# EasyEDA Pro project ProDoc_PCB_ESP_AI_2025-02-27(1)(1).epro

# Board PCB_ESP_AI
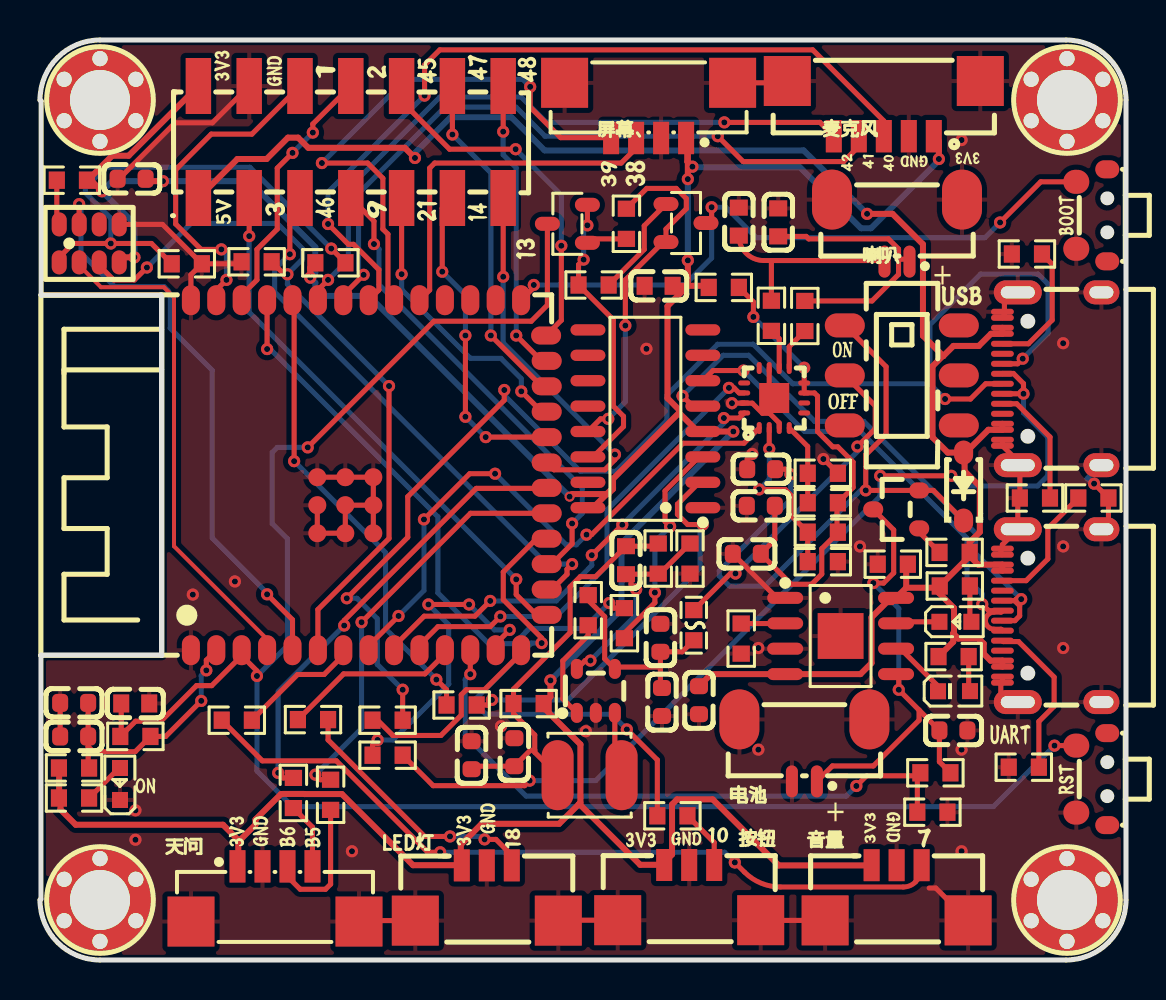
[diagram p0: board, top side]
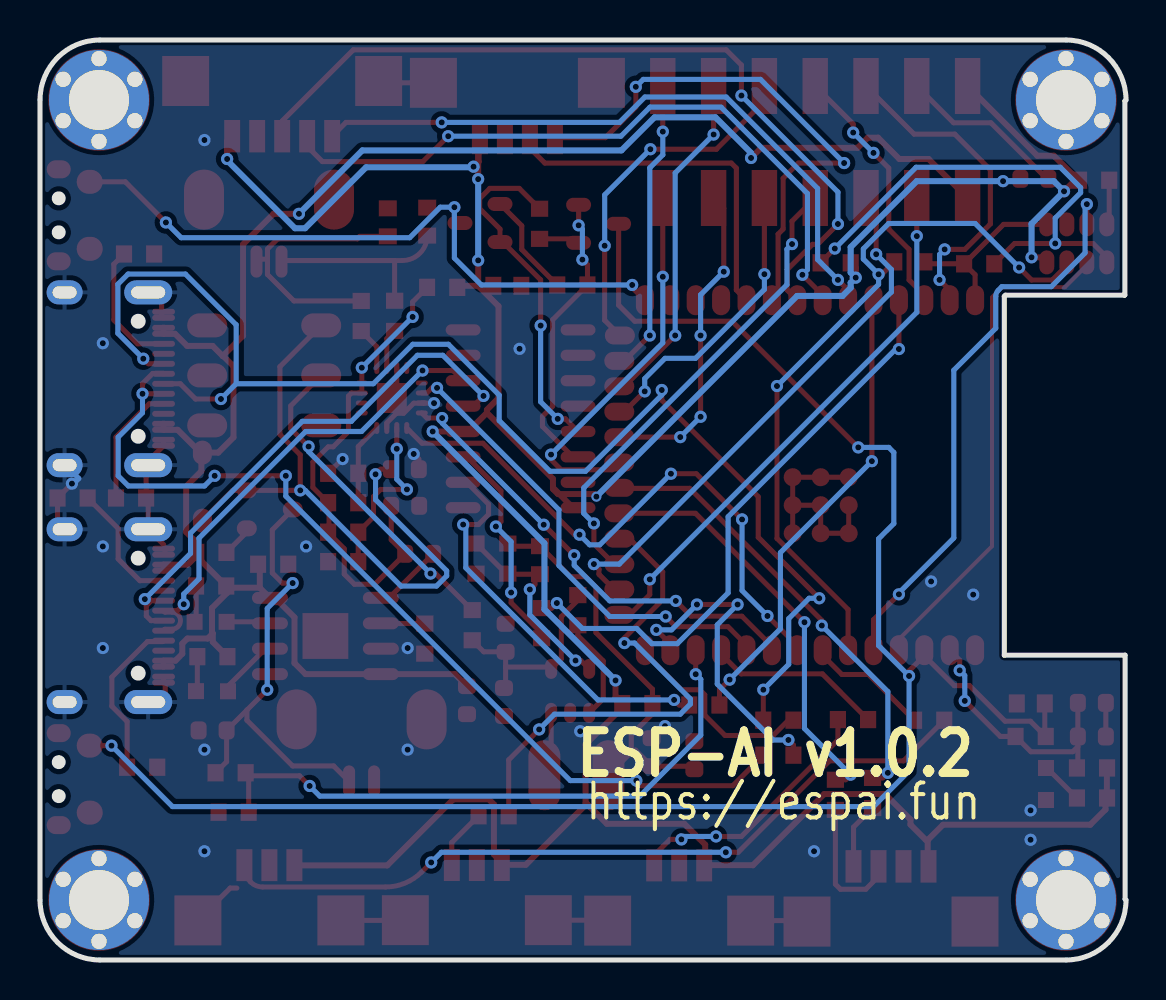
[diagram p1: board, bottom side, seen from below]

Outline 54.3 x 46 mm; copper layers: Top Layer, Bottom Layer. Coordinates in mm from the lower left corner of the outline.
Outline path: 0,43 0.06,42.94 0.06,33.26 0.07,33.24 6.03,33.24 6.08,33.18 6.08,15.24 0.05,15.24 0.05,3.05 0,3 arc(0.88,0.88) 3,0 51.3,0 arc(53.42,0.88) 54.3,3 54.3,43 arc(53.42,45.12) 51.3,46 3,46 arc(0.88,45.12) 0,43
Stack: Top Layer 0.035mm / Dielectric1 1.51mm FR4 er 4.5 / Bottom Layer 0.035mm

## Design rules (mm)
template: JLCPCB Capability(Two Layers Board)
spacing copperThickness1oz (default): track to track 0.102, other pairs 0.152 to 0.3
spacing copperThickness2oz: track to track 0.203, other pairs 0.152 to 0.3
track width copperThickness1oz (default): min 0.127, default 0.254, max 2.54
track width copperThickness2oz: min 0.203, default 0.254, max 2.54
differential pair differentialPair (default): width min 0.127, default 0.254, max 2.54; gap min 0.152, default 0.152
via viaSize (default): diameter min 0.5, default 0.61, max 10; hole min 0.3, default 0.305, max 6.3

## Placement (name value [footprint] x y rotation side)
C1  10uF  [C0603]  36.06 24.54 0 top
C2  10uF  [C0603]  31.02 16.11 270 top
C3  100nF  [C0603]  31.1 12.9 90 top
C4  22pF  [C0603_1]  29.3 19.99 90 top
C5  100nF  [C0603]  21.58 10.24 90 top
C6  10uF  [C0603]  23.72 10.39 90 top
C7  10uF  [C0603]  32.95 12.99 90 top
C8  10uF  [C0603]  45.67 11.48 180 top
C9  10uF  [C0603]  1.71 12.86 0 top
C10  100nF  [C0603]  1.71 11.18 0 top
C11  1uF  [C0603_1]  4.76 12.83 180 top
C12  100nF  [C0603]  4.58 39.06 180 top
C13  100nF  [C0603_1]  30.93 33.71 180 top
C14  10uF  [C0603]  36.04 22.71 180 top
C15  100nF  [C0603]  35.34 20.31 180 top
C16  220pF  [C0603_1]  36.91 36.88 270 top
C17  220pF  [C0603_1]  34.94 36.92 270 top
D1  B5819W SL  [SOD-123_L2.7-W1.6-LS3.7-RD-1]  46.18 23.67 90 top
F1  JK-SMD0603-100L  [F0603]  32.69 16.74 90 top
HDR2  PZ254-2-07-S  [HDR-SMD_14P-P2.54-V-M-R2-C7-LS7.4]  15.54 40.9 0 top
L1  2.2uH  [IND-SMD_L4.0-W4.0]  27.48 9.24 180 top
LED1  KT-0603R  [LED0603-RD]  4 8.8 90 top
LED2  KT-0603R  [LED0603-RD]  45.77 16.91 0 top
LED灯  HC-1.25-3PLT  [CONN-SMD_HC-1.25-3PLT]  22.34 3.35 0 top
M1  -  [M3*5安装孔]  3 3 0 top
M2  -  [M3*5安装孔]  51.35 3 0 top
M3  -  [M3*5安装孔]  3 43 0 top
M4  -  [M3*5安装孔]  51.35 43 0 top
Q1  AO3401A  [SOT-23_L2.9-W1.3-P1.90-LS2.4-BR]  42.81 22.53 0 top
Q4  SS8050  [SOT-23-3_L2.9-W1.3-P1.90-LS2.4-BR]  32.3 36.85 180 top
Q5  SS8050  [SOT-23-3_L2.9-W1.3-P1.90-LS2.4-BR]  26.37 36.81 0 top
R1  5.1kΩ  [R0603]  49.75 23.1 0 top
R2  5.1kΩ  [R0603]  49.35 35.3 180 top
R3  100kΩ  [R0603]  45.73 20.38 0 top
R4  100kΩ  [R0603]  42.64 19.79 0 top
R5  5.1kΩ  [R0603]  49.19 9.64 0 top
R6  5.1kΩ  [R0603]  52.67 23.1 0 top
R7  0Ω  [R0603_1]  24.43 12.82 0 top
R8  10kΩ  [R0603_1]  27.41 17.49 270 top
R9  680kΩ  [R0603_1]  30.91 20.07 90 top
R10  5.1kΩ  [R0603]  1.7 8.1 0 top
R11  150kΩ  [R0603_1]  32.5 20.07 90 top
R12  5.1kΩ  [R0603]  45.68 15.17 0 top
R13  5.1kΩ  [R0603]  45.74 18.7 0 top
R14  1kΩ  [R0603]  35.06 16.07 90 top
R15  300kΩ  [R0603]  44.77 9.36 0 top
R16  100kΩ  [R0603]  44.62 7.39 180 top
R17  0Ω  [R0603_1]  1.7 9.6 0 top
R18  10kΩ  [R0603_1]  4.77 11.18 0 top
R19  0Ω  [R0603_1]  17.38 10.24 0 top
R20  0Ω  [R0603_1]  17.38 11.99 0 top
R21  10kΩ  [R0603_1]  27.68 33.75 180 top
R22  0Ω  [R0603_1]  21.08 12.75 180 top
R23  0Ω  [R0603_1]  29.22 16.84 90 top
R24  100kΩ  [R0603]  10.83 34.91 0 top
R25  10kΩ  [R0603_1]  29.32 36.81 90 top
R26  10kΩ  [R0603_1]  1.59 38.99 0 top
R27  10kΩ  [R0603_1]  14.52 34.86 180 top
R28  10kΩ  [R0603_1]  7.34 34.81 0 top
R29  10kΩ  [R0603_1]  39.14 24.34 180 top
R30  10kΩ  [R0603_1]  39.14 22.86 180 top
R31  10kΩ  [R0603_1]  39.14 19.92 180 top
R32  10kΩ  [R0603_1]  39.14 21.39 180 top
R33  0Ω  [R0603_1]  34.19 33.63 0 top
R34  0Ω  [R0603_1]  36.57 32.21 90 top
R35  0Ω  [R0603_1]  38.24 32.2 90 top
R36  0Ω  [R0603_1]  14.53 8.26 90 top
R37  0Ω  [R0603_1]  12.67 8.35 90 top
R38  0Ω  [R0603_1]  9.84 11.99 0 top
R39  0Ω  [R0603_1]  31.62 7.21 180 top
R40  0Ω  [R0603_1]  13.65 12.02 180 top
SW1  MST22D18G2 125  [SW-SMD_MST22D18G2]  43.09 29.23 270 top
SW2  TS24CA  [SW-SMD_TS24CA]  52.59 37.23 270 top
SW3  TS24CA  [SW-SMD_TS24CA]  52.59 9.04 270 top
U1  24018-UCAF001-A  [TYPE-C-USB-SMD_CF003]  50.6 29.06 90 top
U2  24018-UCAF001-A  [TYPE-C-USB-SMD_CF003]  50.6 17.22 90 top
U3  ETA3409S2F  [SOT-23-5_L2.9-W1.6-P0.95-LS2.8-BL]  27.49 13.28 90 top
U4  AP5056  [SOP-8_L4.9-W3.9-P1.27-LS6.0-BL-EP]  40.03 16.2 270 top
U5  19-217/GHC-YR1S2/6T  [LED0603-RD_GREEN]  45.7 13.44 0 top
U7  ESP32-S3-WROOM-1-N16R8  [WIRELM-SMD_ESP32-S3-WROOM-1]  16.44 24.24 90 top
U8  CH340C  [SOP-16_L10.0-W3.9-P1.27-LS6.0-BL]  30.27 27.06 90 top
U9  MSM261S4030H0R  [MIC-SMD_8P-L4.0-W3.0-P1.00-BR]  2.46 35.83 90 top
U10  MAX98357AETE+T  [TQFN-16_L3.0-W3.0-P0.50-BL-EP1.5]  36.71 28.1 0 top
喇叭  HCZZ0015-2  [CONN-SMD_HCZZ0015-2]  42.85 36.47 180 top
天问  HC-1.25-4PLT  [CONN-SMD_4P-P1.25_HCTL_HC-1.25-4PLT]  11.75 3.3 0 top
屏幕、  HC-1.25-4PLT  [CONN-SMD_4P-P1.25_HCTL_HC-1.25-4PLT]  30.43 42.48 180 top
按钮  HC-1.25-3PLT  [CONN-SMD_HC-1.25-3PLT]  32.46 3.37 0 top
电池  HCZZ0015-2  [CONN-SMD_HCZZ0015-2]  38.22 10.48 180 top
音量  HC-1.25-3PLT  [CONN-SMD_HC-1.25-3PLT]  42.83 3.36 0 top
麦克风  HC-1.25-5PLT  [CONN-SMD_5P-P1.25_HCTL_HC-1.25-5PLT]  42.19 42.57 180 top

## Footprints (pads in the part's own frame, mm; a bottom-side part is the same pattern mirrored in y, then rotated)
C0603
  rrect 0.8x0.9 smd: 1(-0.7,0) 2(0.7,0)
C0603_1
  rect 0.8x0.9 smd: 1(-0.7,0) 2(0.7,0)
CONN-SMD_4P-P1.25_HCTL_HC-1.25-4PLT
  rect 0.8x1.62 smd: 1(-1.875,1.38) 2(-0.625,1.38) 3(0.625,1.38) 4(1.875,1.38)
  rect 2.35x2.5 smd: 5(-4.2,-1.38) 6(4.2,-1.38)
CONN-SMD_5P-P1.25_HCTL_HC-1.25-5PLT
  rect 0.8x1.62 smd: 1(-2.5,1.38) 2(-1.25,1.38) 3(0,1.38) 4(1.25,1.38) 5(2.5,1.38)
  rect 2.35x2.5 smd: 6(4.825,-1.38) 7(-4.825,-1.38)
CONN-SMD_HC-1.25-3PLT
  rect 0.8x1.6 smd: 1(-1.25,1.38) 2(0,1.38) 3(1.25,1.38)
  rect 2.35x2.5 smd: 4(-3.575,-1.38) 5(3.575,-1.38)
CONN-SMD_HCZZ0015-2
  oval 0.6x1.6 smd: 1(-0.625,1.55) 2(0.625,1.55)
  oval 2x3 smd: 3(-3.25,-1.55) 4(3.25,-1.55)
F0603
  rect 0.806x0.864 smd: 1(-0.753,0) 2(0.753,0)
HDR-SMD_14P-P2.54-V-M-R2-C7-LS7.4
  rect 1.27x2.8 smd: 1(-7.62,-2.8) 2(-7.62,2.8) 3(-5.08,-2.8) 4(-5.08,2.8) 5(-2.54,-2.8) 6(-2.54,2.8) 7(0,-2.8) 8(0,2.8) 9(2.54,-2.8) 10(2.54,2.8) 11(5.08,-2.8) 12(5.08,2.8) 13(7.62,-2.8) 14(7.62,2.8)
IND-SMD_L4.0-W4.0
  oval 1.6x3.5 smd: 1(-1.6,0) 2(1.6,0)
LED0603-RD
  rect 0.8x0.8 smd: 1(-0.799,0) 2(0.799,0)
LED0603-RD_GREEN
  rect 0.8x0.8 smd: 1(-0.799,-0.004) 2(0.799,0.004)
M3*5安装孔
  round 0.762 hole 0.762: 1(1.793,1.035) 2(0,2.07) 5(-1.793,1.035) 6(-1.792,-1.035) 8(0,-2.07) 9(1.792,-1.035)
  round 5.08 smd: 3(0,0)
  round 5 smd far side: 4(0,0)
  round 3.2 hole 3: 7(0,0)
MIC-SMD_8P-L4.0-W3.0-P1.00-BR
  oval 1.2x0.75 smd: 1(0.95,-1.5) 2(0.95,-0.5) 3(0.95,0.5) 4(0.95,1.5) 5(-0.95,1.5) 6(-0.95,0.5) 7(-0.95,-0.5) 8(-0.95,-1.5)
R0603
  rect 0.806x0.864 smd: 1(-0.753,0) 2(0.753,0)
R0603_1
  rect 0.806x0.864 smd: 1(-0.753,0) 2(0.753,0)
SOD-123_L2.7-W1.6-LS3.7-RD-1
  oval 1.2x0.95 smd: 1(-1.7,0) 2(1.7,0)
SOP-8_L4.9-W3.9-P1.27-LS6.0-BL-EP
  oval 0.6x1.8 smd: 1(-1.905,-2.772) 2(-0.635,-2.772) 3(0.635,-2.772) 4(1.905,-2.772) 5(1.905,2.772) 6(0.635,2.772) 7(-0.635,2.772) 8(-1.905,2.772)
  rect 2.29x2.29 smd: 9(0,0)
SOP-16_L10.0-W3.9-P1.27-LS6.0-BL
  oval 0.56x1.745 smd: 1(-4.445,-2.873) 2(-3.175,-2.873) 3(-1.905,-2.873) 4(-0.635,-2.873) 5(0.635,-2.873) 6(1.905,-2.873) 7(3.175,-2.873) 8(4.445,-2.873) 9(4.445,2.873) 10(3.175,2.873) 11(1.905,2.873) 12(0.635,2.873) 13(-0.635,2.873) 14(-1.905,2.873) 15(-3.175,2.873) 16(-4.445,2.873)
SOT-23-3_L2.9-W1.3-P1.90-LS2.4-BR
  oval 1.25x0.7 smd: 1(1,-0.95) 2(1,0.95) 3(-1,0)
SOT-23-5_L2.9-W1.6-P0.95-LS2.8-BL
  oval 1x0.6 smd: 1(-0.924,0.647) 2(-0.924,-0.302) 3(-0.924,-1.252) 4(1.276,-1.252) 5(1.276,0.647)
SOT-23_L2.9-W1.3-P1.90-LS2.4-BR
  oval 1x0.8 smd: 1(1.15,-0.95) 2(1.15,0.95) 3(-1.15,0)
SW-SMD_MST22D18G2
  oval 1.2x2 smd: 1(-2.5,2.85) 2(0,2.85) 3(2.5,2.85) 4(-2.5,-2.85) 5(0,-2.85) 6(2.5,-2.85)
SW-SMD_TS24CA
  oval 0.9x1.2 smd: 1(-2.3,0.775) 2(2.3,0.775)
  oval 1.2x1.3 smd: 3(-1.675,-0.775) 4(1.675,-0.775)
TQFN-16_L3.0-W3.0-P0.50-BL-EP1.5
  oval 0.25x0.6 smd: 1(-0.749,-1.5) 2(-0.248,-1.5) 3(0.252,-1.5) 4(0.751,-1.5) 9(0.75,1.5) 10(0.25,1.5) 11(-0.25,1.5) 12(-0.749,1.5)
  oval 0.6x0.25 smd: 5(1.5,-0.748) 6(1.5,-0.248) 7(1.5,0.252) 8(1.5,0.752) 13(-1.5,0.752) 14(-1.5,0.252) 15(-1.5,-0.248) 16(-1.5,-0.748)
  rect 1.5x1.5 smd: 17(0,0)
TYPE-C-USB-SMD_CF003
  oval 1.2x2.4 hole 0.6x1.7: 17(4.32,1.705) 20(-4.32,1.705)
  oval 1.2x1.8 hole 0.6x1.2: 18(4.32,-2.475) 19(-4.32,-2.475)
  oval 0.3x1.14 smd: A1(-3.35,2.474) A4(-2.55,2.471) A5(-1.25,2.475) A6(-0.25,2.475) A7(0.25,2.474) A8(1.25,2.475) A9(2.55,2.475) A12(3.35,2.475) B1(3.05,2.475) B4(2.25,2.475) B5(1.75,2.475) B6(0.75,2.475) B7(-0.75,2.474) B8(-1.75,2.475) B9(-2.25,2.471) B12(-3.05,2.474)
WIRELM-SMD_ESP32-S3-WROOM-1
  oval 1.5x0.9 smd: 1(-8.75,8.895) 2(-8.75,7.625) 3(-8.75,6.355) 4(-8.75,5.085) 5(-8.75,3.815) 6(-8.75,2.545) 7(-8.75,1.275) 8(-8.75,0.005) 9(-8.75,-1.265) 10(-8.75,-2.535) 11(-8.75,-3.805) 12(-8.75,-5.075) 13(-8.75,-6.345) 14(-8.75,-7.615) 27(8.75,-7.615) 28(8.75,-6.345) 29(8.75,-5.075) 30(8.75,-3.805) 31(8.75,-2.535) 32(8.75,-1.265) 33(8.75,0.005) 34(8.75,1.275) 35(8.75,2.545) 36(8.75,3.815) 37(8.75,5.085) 38(8.75,6.355) 39(8.75,7.625) 40(8.75,8.895)
  oval 0.9x1.5 smd: 15(-6.985,-8.895) 16(-5.715,-8.895) 17(-4.445,-8.895) 18(-3.175,-8.895) 19(-1.905,-8.895) 20(-0.635,-8.895) 21(0.635,-8.895) 22(1.905,-8.895) 23(3.175,-8.895) 24(4.445,-8.895) 25(5.715,-8.895) 26(6.985,-8.865)
  oval 0.9x0.9 smd: 41(-2.9,2.575) 41(-2.9,1.175) 41(-2.9,-0.225) 41(-1.5,2.575) 41(-1.5,1.175) 41(-1.5,-0.225) 41(-0.1,2.575) 41(-0.1,1.175) 41(-0.1,-0.225)

## Nets
GND: C1.1 C2.1 C3.1 C5.2 C6.2 C7.1 C8.1 C9.1 C10.1 C11.1 C12.2 C13.2 C14.2 C15.2 C16.1 C17.1 HDR2.4 LED1.1 LED灯.2 LED灯.4 LED灯.5 R1.1 R2.2 R4.1 R5.1 R6.2 R11.1 R14.1 R16.1 R24.1 R28.2 R29.1 R31.1 SW2.4 SW3.4 U1.17 U1.18 U1.19 U1.20 U1.A1 U1.A12 U1.B1 U1.B12 U2.17 U2.18 U2.19 U2.20 U2.A1 U2.A12 U2.B1 U2.B12 U3.2 U4.1 U4.3 U4.9 U7.1 U7.40 U7.41 U8.1 U9.1 U10.3 U10.11 U10.15 U10.17 喇叭.3 喇叭.4 天问.2 天问.5 天问.6 屏幕、.2 屏幕、.5 屏幕、.6 按钮.2 按钮.4 按钮.5 电池.2 电池.3 电池.4 音量.2 音量.4 音量.5 麦克风.2 麦克风.6 麦克风.7
VBAT: C8.2 Q1.3 R15.2 U4.5 电池.1
VCC_3V3: C12.1 C13.1 HDR2.2 LED灯.1 R7.2 R10.1 R17.1 R26.2 R27.2 R33.1 U8.4 U8.16 U9.8 天问.1 屏幕、.1 按钮.1 音量.1 麦克风.1
VCC_BOARD: F1.2 SW1.5
ASR_PB5: R37.1 天问.4
ASR_PB6: R36.1 天问.3
AUX_VCC: C1.2 D1.1 Q1.2 SW1.4
BAT_CHRG: LED2.1 U4.7
BAT_STBY: U4.6 U5.1
DTR: Q4.2 R25.2 U8.13
EN_RST: C11.2 Q5.3 R18.1 SW3.3 U7.3
GAIN_CTRL: R31.2 R32.2 U10.2
IO0_BOOT: Q4.3 SW2.3 U7.27
IO1_EXD: HDR2.6 U7.39
IO2_EXD: HDR2.8 U7.38
IO3_EXD: HDR2.3 U7.15
IO4_SCK: U7.4 U9.6
IO5_WS: U7.5 U9.3
IO6_SD: R24.2 U7.6 U9.7
IO7_KNOB: R38.2 U7.7
IO8_BAT_ADC: R15.1 R16.2 U7.12
IO9_EXD: HDR2.7 U7.17
IO10_BTN: R39.2 U7.18
IO11_TX_TW: R36.2 U7.19
IO12_RX_TW: R37.2 U7.20
IO13_EXD: HDR2.13 U7.21
IO14_EXD: HDR2.11 U7.22
IO15_DIN: U7.8 U10.1
IO16_BCLK: U7.9 U10.16
IO17_LR: U7.10 U10.14
IO18_LED: R40.2 U7.11
IO19_USB_D-: R19.2 U1.A7 U1.B7
IO20_USB_D+: R20.2 U1.A6 U1.B6
IO21_EXD: HDR2.9 U7.23
IO38_EXD: U7.31 屏幕、.3
IO39_EXD: U7.32 屏幕、.4
IO40_EXD: U7.33 麦克风.3
IO41_EXD: U7.34 麦克风.4
IO42_EXD: U7.35 麦克风.5
IO43_TX: R23.2 U7.37
IO44_RX: R22.2 U7.36
IO45_EXD: HDR2.10 U7.26
IO46_EXD: HDR2.5 U7.16
IO47_EXD: HDR2.12 U7.24
IO48_EXD: HDR2.14 U7.25
MAX_3V3: C14.1 C15.1 R30.1 R32.1 R33.2 U10.7 U10.8
RTS: Q5.2 R21.2 U8.14
SD_MODE: R29.2 R30.2 U10.4
USB_5V: C7.2 D1.2 HDR2.1 R3.2 R4.2 R12.1 R13.1 U1.A4 U1.A9 U1.B4 U1.B9 U2.A4 U2.A9 U2.B4 U2.B9 U4.4 U4.8
USB_D+: U2.A6 U2.B6 U8.5
USB_D-: U2.A7 U2.B7 U8.6
$1N4709: R1.2 U1.A5
$1N4722: R2.1 U1.B5
$1N5072: Q1.1 R3.1
$1N5555: LED1.2 R10.2
$1N6052: C4.2 C5.1 C6.1 L1.2 R7.1 R9.2
$1N6054: L1.1 U3.3
$1N6055: C4.1 R9.1 R11.2 U3.5
$1N6057: C2.2 C3.2 F1.1 R8.1 U3.4
$1N6058: R8.2 U3.1
$1N8206: R12.2 U5.2
$1N8207: LED2.2 R13.2
$1N8211: R14.2 U4.2
$1N11656: R6.1 U2.B5
$1N11663: R5.2 U2.A5
$2N631: C9.2 C10.2 R17.2 R18.2 U7.2
$2N764: R20.1 U7.14
$2N769: R19.1 U7.13
$3N640: R22.1 U8.2
$3N641: R23.1 U8.3
$3N2290: R34.1 U10.10
$3N2291: R35.1 U10.9
$3N2292: C17.2 R34.2 喇叭.2
$3N2293: C16.2 R35.2 喇叭.1
$3N9618: R26.1 U9.4
$3N9620: R27.1 R28.1 U9.5
$3N12428: Q4.1 R21.1
$3N12472: Q5.1 R25.1
$4N844: LED灯.3 R40.1
$4N967: R38.1 音量.3
$4N1500: R39.1 按钮.3

Pads without a net: M1 1 2 3 4 5 6 7 8 9; M2 1 2 3 4 5 6 7 8 9; M3 1 2 3 4 5 6 7 8 9; M4 1 2 3 4 5 6 7 8 9; SW1 1 2 3 6; SW2 1 2; SW3 1 2; U1 A8 B8; U2 A8 B8; U7 28 29 30; U8 7 8 9 10 11 12 15; U9 2; U10 5 6 12 13

## Via types
v1: diameter 0.61, hole 0.305, Top Layer to Bottom Layer, 143 vias
v2: diameter 0.5, hole 0.305, Top Layer to Bottom Layer, 1 via

## Routing (per net, layer and track width the routed paths; a pad name or vN(x,y) marks a point on that pad's centre or on a via; arc(x,y) is an arc through that point)
GND: length 71.1
  Top Layer w0.25: v1(35.61,25.3) 35.36,25.05 35.36,24.54 ; 36.48,27.33 36.12,27.33 35.61,27.84 35.11,27.84 ; 36.48,27.33 36.96,26.85 U10.3 ; 36.48,27.33 36.48,27.87 U10.17 36.46,28.35 U10.11 ; 35.11,27.84 v1(34.6,27.84) ; 35.11,27.84 U10.15 ; v1(39.17,25.05) 39.18,25.05 R29.1
  Top Layer w0.254: 34.63,43.86 37.27,43.86 麦克风.6 ; U1.B1 48.22,32.21 48.22,32.37 ; U4.1 36.85,18.11 34.64,20.31 ; U2.B12 U2.A1 48.04,13.79 48.04,12.9 U2.20 ; U7.41 U7.41 U7.41 U7.41 ; 48.22,32.37 48.22,33.38 U1.17 ; 48.22,32.37 48.17,32.37 U1.A12 ; U1.B12 U1.A1 48.89,24.94 U1.20 48.99,24.64 R1.1 48.89,23 U2.17 48.12,20.77 U2.A12 48.07,20.52 48.04,20.52 48.04,20.35 U2.B1 ; U9.1 6.12,36.78 R28.2 ; 音量.4 36.05,1.98 按钮.5 ; U7.40 7.55,34.26 R28.2 ; U7.41 U7.41 U7.41 U7.41 U7.41 ; U7.41 U7.41 ; 44.46,3.6 44.79,3.6 音量.5 ; 按钮.4 25.94,1.99 LED灯.5 ; HDR2.4 8.62,41.86 6.75,41.86 3.96,39.07 3.96,38.98 C12.2 ; R24.1 9.98,34.81 R28.2 ; v1(52.7,23.82) R6.2 53.42,21.89 U2.18 ; C10.1 C9.1 ; 48.73,35.16 R2.2 ; LED灯.4 15.97,1.97 15.95,1.95 天问.6
  Bottom Layer w0.254: v1(52.7,23.82) 52.61,23.82 52.36,24.07 53.03,24.74 U1.19
  vias: v1(4.77,7.48) v1(4.77,6.01) v1(7.64,18.27) v1(9.75,18.93) v1(15.6,5.44) v1(23.05,11.69) v1(27.29,11.44) v1(30.32,30.56) v1(35.92,15.6) v1(35.92,10.52) v1(41,20.68) v1(46.08,41) v1(46.08,10.52) v1(46.08,5.44) v1(51.16,30.84) v1(51.16,20.68) v1(51.16,15.6)
VBAT: length 23.6
  Top Layer w0.254: 43.95,12.5 C8.2 44.97,9.91 R15.2 ; 43.95,12.5 43.95,11.99 41.67,9.7 39.62,9.7 电池.1 ; 43.95,12.5 v1(42.94,13.51) 42.94,14.16 U4.5 ; v1(41.67,18.85) 42.18,18.85 42.68,19.35 42.68,21.51 Q1.3
  Bottom Layer w0.254: v1(42.94,13.51) 42.94,17.58 v1(41.67,18.85)
VCC_3V3: length 171.1
  Top Layer w0.3: 27.4,22.62 27.65,22.62 28.33,23.3 ; 21.08,4.74 LED灯.1 ; 21.08,4.74 21.04,4.78 21.04,5.77 22.09,6.81 25.96,6.81 26.96,7.81 26.96,7.81 ; 21.08,4.74 18.65,4.74 15.09,8.3 13.23,8.3 13.23,8.3 12.11,8.3 12.11,8.3 12.05,8.3 10.78,7.03 10.78,6.77 10,6 9.91,6 ; 31.03,4.76 31.09,4.76 31.6,5.28 31.6,7.78 31.86,8.03 33.63,8.03 36.94,4.73 41.57,4.73 音量.1 ; 31.03,4.76 按钮.1 ; 31.03,4.76 30.01,4.76 26.96,7.81 ; 28.65,23.62 28.65,23.55 28.4,23.3 28.33,23.3 ; 28.65,23.62 28.33,23.3 ; 28.65,23.62 28.65,24.06 31.95,27.36 ; 31.63,33.71 32.39,33.71 ; 32.39,33.71 31.38,32.69 31.38,28.09 31.95,27.51 31.95,27.36 ; 32.39,33.71 33.36,33.71 R33.1 ; 32.39,33.71 v1(32.39,34.98) ; 2.35,38.99 2.54,38.99 2.59,38.94 ; 0.96,8.1 R10.1 ; 0.96,8.1 0.96,9.59 R17.1 ; 0.96,8.1 1.02,8.03 1.02,7.52 1.79,6.76 9.15,6.76 9.91,6 ; 31.95,27.36 32.89,26.42 U8.4 v1(34.67,26.42) ; 9.91,6 9.91,4.72 9.87,4.68 ; v1(3.1,38.44) 2.59,38.94 ; 2.59,38.94 2.59,39.2 3.61,40.21 4.43,40.21 HDR2.2 ; 麦克风.1 44.94,40.94 v1(44.94,40.05) ; 28.33,23.3 26.61,23.3 v2(26.48,23.17) ; 32.37,41.1 屏幕、.1 ; 32.37,41.1 32.37,39.92 32.39,39.9 ; 32.37,41.1 32.39,41.08 32.39,39.9 ; v1(6.15,38.94) 5.4,38.94 5.28,39.06 ; 32.39,39.9 v1(32.62,39.67) ; 32.39,39.9 v1(32.39,39.04) ; 26.96,7.81 27.02,7.87 27.02,10.78 25.24,12.56 25.24,12.76 R7.2 25.52,13.16 v1(25.52,13.98) ; v1(4.72,35.13) 4.21,35.13 U9.8 ; R27.2 13.51,34.61 v1(13.51,34.12)
  Bottom Layer w0.3: v1(34.67,26.42) 29.08,20.84 29.08,17.53 v1(25.52,13.98) ; v2(26.48,23.17) 16.45,33.2 14.17,33.2 13.77,33.61 13.77,33.86 v1(13.51,34.12) 13.77,34.37 13.77,35.64 10.46,38.94 v1(6.15,38.94) 3.61,38.94 v1(3.1,38.44) 4.72,36.81 v1(4.72,35.13) ; v1(32.62,39.67) 32.65,39.64 38,39.64 41.04,36.59 41.55,36.59 44.94,39.98 v1(44.94,40.05) ; v1(32.39,34.98) v1(32.39,39.04)
VCC_BOARD: length 16.3
  Top Layer w0.254: 40.24,29.23 41.76,27.71 41.76,26.57 v1(40.87,25.67) ; F1.2 34.52,19.32 v1(34.77,19.32)
  Bottom Layer w0.254: v1(40.87,25.67) 40.87,25.42 v1(34.77,19.32)
ASR_PB5: length 3.3
  Top Layer w0.254: 13.62,4.68 13.62,6.64 R37.1
ASR_PB6: length 6.7
  Top Layer w0.254: R36.1 14.53,3.79 14.28,3.54 13.01,3.54 12.5,4.05 12.5,4.55 12.37,4.68
AUX_VCC: length 32
  Top Layer w0.254: D1.1 44.67,23.48 v1(41.29,23.48) 41.29,25.26 42.3,26.27 42.3,29.67 40.24,31.73 ; C1.2 37.27,24.54 v1(37.52,24.29)
  Bottom Layer w0.254: v1(37.52,24.29) 37.52,23.02 33.97,19.46 33.97,19.21 34.47,18.7 36.25,18.7 41.03,23.48 v1(41.29,23.48)
BAT_CHRG: length 2.2
  Top Layer w0.254: U4.7 42.88,16.91 LED2.1
BAT_STBY: length 3.1
  Top Layer w0.254: U4.6 43.03,15.56 44.83,13.76 44.83,13.5 U5.1
DTR: length 17.7
  Top Layer w0.254: U8.13 28.03,27.06 v1(28.41,27.06) ; 31.3,36.04 29.27,34.01 v1(29.27,31.72) ; 31.3,36.04 31.3,36.55 32.32,37.56 32.32,38.07 31.81,38.58 30.34,38.58 R25.2 ; 31.3,36.04 Q4.2
  Bottom Layer w0.254: v1(28.41,27.06) 29.27,27.91 v1(29.27,31.72)
EN_RST: length 91.7
  Top Layer w0.254: v1(13.39,25.63) 19.7,31.94 24.56,31.94 25.37,32.75 Q5.3 ; v1(50.73,10.72) 51.81,10.72 ; 4.06,11.22 4.78,11.94 6.05,11.94 7.83,13.72 8.59,13.72 10.08,15.22 ; 4.06,11.22 R18.1 ; 4.06,11.22 C11.2 ; v1(10.85,14.2) 10.85,14.45 10.08,15.22 ; 10.08,15.22 U7.3
  Bottom Layer w0.254: v1(13.39,25.63) 11.86,25.63 11.61,25.38 11.61,21.82 12.37,21.06 12.37,15.72 v1(10.85,14.2) 10.85,9.45 12.63,7.67 47.68,7.67 v1(50.73,10.72)
GAIN_CTRL: length 8.7
  Top Layer w0.25: v1(36.46,25.56) U10.2 ; v1(35.95,23.53) 37.26,23.53 37.62,23.17 37.62,22.15 R32.2
  Top Layer w0.254: R31.2 R32.2
  Bottom Layer w0.25: v1(36.46,25.56) 36.46,24.04 v1(35.95,23.53)
IO0_BOOT: length 33.9
  Top Layer w0.254: U7.27 24.69,33.63 v1(24.69,33.75) ; v1(48,36.88) 50.04,38.91 SW2.3 ; v1(33.58,37.64) 33.58,37.13 Q4.3
  Bottom Layer w0.254: v1(24.69,33.75) 32.23,33.75 33.58,35.1 v1(33.58,37.64) 34.29,37.64 35.81,36.12 47.24,36.12 v1(48,36.88)
IO1_EXD: length 16.3
  Top Layer w0.254: U7.39 8.82,33.5 v1(9.32,34.01) ; HDR2.6 10.59,41.29 8.56,41.29 6.78,39.52 6.78,36.8 8.05,35.53 v1(9.07,35.53)
  Bottom Layer w0.254: v1(9.32,34.01) 9.32,35.28 v1(9.07,35.53)
IO2_EXD: length 13
  Top Layer w0.254: v1(13.64,41.37) 13.64,41.8 HDR2.8 ; v1(12.63,40.36) 11.86,39.59 11.86,36.55 10.85,35.53 10.85,34.01 10.08,33.24 U7.38
  Bottom Layer w0.254: v1(12.63,40.36) v1(13.64,41.37)
IO3_EXD: length 27.3
  Top Layer w0.254: v1(10.46,36.19) HDR2.3 ; v1(23.81,19.03) 23.81,18.27 24.83,17.26 U7.15
  Bottom Layer w0.254: v1(23.81,19.03) 10.46,32.38 v1(10.46,36.19)
IO4_SCK: length 25.1
  Top Layer w0.2: U9.6 1.96,34.73 3.05,33.64 6.19,33.64 6.7,33.13 6.7,20.69 11.36,16.03 U7.4
IO5_WS: length 29.2
  Top Layer w0.254: v1(1.96,37.79) 1.96,36.78 ; v1(11.36,18.28) 12.63,17.01 U7.5
  Bottom Layer w0.254: v1(1.96,37.79) 2.05,37.7 2.05,35.35 3.73,33.67 6.2,33.67 6.39,33.49 arc(6.48,33.35) 6.51,33.18 6.51,31.59 8.61,29.49 8.61,21.1 11.36,18.35 v1(11.36,18.28)
IO6_SD: length 37.3
  Top Layer w0.254: v1(5.35,34.63) 4.72,34 3.68,34 2.96,34.73 U9.7 ; U7.6 13.89,17.52 17.45,21.08 v1(17.45,28.7) ; v1(12.37,34.29) 12.21,34.29 R24.2
  Bottom Layer w0.254: v1(17.45,28.7) 12.37,33.78 v1(12.37,34.29) 13.13,35.05 13.13,35.56 11.86,36.83 7.55,36.83 v1(5.35,34.63)
IO7_KNOB: length 6.2
  Top Layer w0.254: U7.7 15.17,15.24 14.2,14.28 12.88,14.28 R38.2
IO8_BAT_ADC: length 30.7
  Top Layer w0.254: v1(40.82,8.7) 41.33,9.21 43.87,9.21 ; R15.1 43.87,9.21 ; 43.87,9.21 R16.2 ; v1(21.51,14.29) U7.12
  Bottom Layer w0.254: v1(40.82,8.7) 40.31,8.19 24.31,8.19 21.26,11.24 21.26,14.04 v1(21.51,14.29)
IO9_EXD: length 24
  Top Layer w0.254: HDR2.7 16.7,36.94 v1(16.7,35.8) ; U7.17 25.59,19.8 26.61,20.81 v1(26.61,21.83)
  Bottom Layer w0.254: v1(26.61,21.83) 27.11,22.34 27.11,23.61 16.95,33.77 16.95,35.54 v1(16.7,35.8)
IO10_BTN: length 25
  Top Layer w0.254: 25.33,21.06 25.2,20.93 24.69,20.93 23.16,19.4 23.16,18.02 25.08,16.1 v1(25.08,15.85) ; v1(29.34,11.53) 30.87,10 R39.2
  Bottom Layer w0.254: v1(29.34,11.53) 28.58,12.29 22.29,12.29 21.78,12.8 21.78,13.05 24.57,15.85 v1(25.08,15.85)
IO11_TX_TW: length 21
  Top Layer w0.254: U7.19 21.52,22.34 v1(16.08,16.89) ; R36.2 14.02,9.01 v1(13.77,9.27)
  Bottom Layer w0.254: v1(16.08,16.89) 16.08,11.58 v1(13.77,9.27)
IO12_RX_TW: length 22.7
  Top Layer w0.254: v1(11.91,9.36) 12.16,9.1 R37.2 ; U7.20 25.31,23.58 21.81,23.58 15.21,16.98 v1(15.21,16.72)
  Bottom Layer w0.254: v1(11.91,9.36) 11.91,13.42 v1(15.21,16.72)
IO13_EXD: length 19.2
  Top Layer w0.254: v1(23.16,34.16) HDR2.13 ; v1(28.75,25.27) 28.75,25.02 28.24,24.51 25.7,24.51 U7.21
  Bottom Layer w0.254: v1(28.75,25.27) 23.16,30.86 v1(23.16,34.16)
IO14_EXD: length 16.1
  Top Layer w0.254: v1(20.11,34.42) 20.11,37.59 HDR2.11 ; v1(21.27,27.16) v1(21.27,31.23) ; U7.22 v1(22.29,26.15)
  Bottom Layer w0.254: v1(20.11,34.42) 21.27,33.26 v1(21.27,31.23) ; v1(22.29,26.15) v1(21.27,27.16)
IO15_DIN: length 29.3
  Top Layer w0.25: U10.1 35.2,25.84 32.15,25.84 27.58,21.27 v1(27.33,21.27) ; v1(19.2,22.03) 21.48,24.31 v1(22.75,24.31) ; v1(17.93,17.2) 16.44,15.71 U7.8
  Bottom Layer w0.25: v1(27.33,21.27) 26.82,20.76 26.31,20.76 v1(22.75,24.31) ; v1(17.93,17.2) 19.2,18.47 v1(19.2,22.03)
IO16_BCLK: length 23
  Top Layer w0.25: v1(34.19,27.1) 34.96,27.1 U10.16 ; U7.9 17.7,15.69 19.21,17.19 21.75,17.19 v1(22.51,17.95) ; v1(29.11,21.76) v1(27.59,20.24)
  Bottom Layer w0.25: v1(22.51,17.95) 25.81,17.95 27.59,19.73 v1(27.59,20.24) ; v1(34.19,27.1) 34.19,26.84 v1(29.11,21.76)
IO17_LR: length 23.6
  Top Layer w0.25: v1(34.45,28.61) 34.7,28.61 34.96,28.35 U10.14 ; U7.10 18.98,15.74 19.9,16.67 22.51,16.67 v1(23.02,17.18)
  Bottom Layer w0.25: v1(23.02,17.18) 25.81,17.18 28.35,19.72 28.35,22.51 v1(34.45,28.61)
IO18_LED: length 8.9
  Top Layer w0.254: R40.2 15.18,14.31 19.25,14.31 20.25,15.3 U7.11
IO19_USB_D-: length 47.8
  Top Layer w0.254: U1.B7 v1(49.17,28.31) 49.17,28.82 48.67,29.33 48.14,29.33 U1.A7 ; v1(24.48,8.97) 24.23,8.72 19.66,8.72 R19.2 ; v1(42.01,24.21) v1(45.57,24.21)
  Bottom Layer w0.254: v1(45.57,24.21) 46.07,23.7 49.88,23.7 50.39,24.21 50.39,26.14 49.17,27.36 v1(49.17,28.31) ; v1(24.48,8.97) 27.79,8.97 42.01,23.19 v1(42.01,24.21)
IO20_USB_D+: length 68.3
  Top Layer w0.254: v1(49.14,30.07) 48.88,29.81 U1.B6 ; v1(15.34,18.09) 18.39,21.13 18.39,23.17 23.21,27.99 v1(23.21,28.5) ; R20.2 v1(18.13,13.51) ; U1.A6 47.29,28.81 46.52,28.05 v1(45.25,28.05)
  Bottom Layer w0.254: 44.49,28.81 v1(45.25,28.05) ; 44.49,28.81 44.49,31.76 47.03,34.3 49.9,34.3 50.41,33.79 50.41,31.34 v1(49.14,30.07) ; 44.49,28.81 37.63,28.81 35.66,30.79 33.88,30.79 31.34,28.25 31.34,26.98 28.8,24.44 27.02,24.44 23.21,28.25 v1(23.21,28.5) ; v1(18.13,13.51) 16.86,14.78 16.86,17.07 15.85,18.09 v1(15.34,18.09)
IO21_EXD: length 14.7
  Top Layer w0.254: v1(24.07,28.43) 25.08,27.42 U7.23 ; v1(18.08,34.29) HDR2.9
  Bottom Layer w0.254: v1(24.07,28.43) 24.07,29.07 23.05,30.08 21.52,30.08 18.08,33.53 v1(18.08,34.29)
IO38_EXD: length 18.1
  Top Layer w0.254: 屏幕、.3 29.8,40.59 29.06,39.85 19.74,39.85 19.48,39.59 19.48,33.5 U7.31
IO39_EXD: length 27.7
  Top Layer w0.254: U7.32 17.4,33.3 17.4,36.29 17.14,36.55 17.14,39.09 16.38,39.85 v1(14.1,39.85) ; 屏幕、.4 28.54,41.12 26.03,41.12 24.51,42.64 v1(24.51,43.66)
  Bottom Layer w0.254: v1(24.51,43.66) 24.14,44.03 18.28,44.03 v1(14.1,39.85)
IO40_EXD: length 40.7
  Top Layer w0.254: v1(19.23,43.22) 19.23,44.75 19.99,45.51 38.63,45.51 42.19,41.95 麦克风.3 ; v1(14.4,36.8) 15.42,35.78 15.67,35.78 16.94,34.51 16.94,33.5 U7.33
  Bottom Layer w0.254: v1(14.4,36.8) 14.4,38.4 v1(19.23,43.22)
IO41_EXD: length 34.6
  Top Layer w0.254: v1(16.18,34.26) 15.17,33.24 U7.34 ; v1(33.89,41.19) 35.16,39.92 40.18,39.92 40.94,40.68 麦克风.4
  Bottom Layer w0.254: v1(33.89,41.19) 25.25,41.19 23.8,42.64 20.25,42.64 15.93,38.32 15.93,34.51 v1(16.18,34.26)
IO42_EXD: length 33.2
  Top Layer w0.254: v1(34.22,41.88) 39,41.88 麦克风.5 ; v1(14.4,34.01) 13.89,33.5 U7.35
  Bottom Layer w0.254: v1(34.22,41.88) 25.33,41.88 24.05,43.15 19.99,43.15 15.42,38.58 15.42,35.02 v1(14.4,34.01)
IO43_TX: length 29.6
  Top Layer w0.254: v1(28.46,17.85) 28.71,17.59 R23.2 ; v1(11.36,30.55) U7.37
  Bottom Layer w0.254: v1(28.46,17.85) 27.19,16.58 24.47,16.58 23.7,15.82 22.43,15.82 19.89,18.36 19.89,22.17 11.51,30.55 v1(11.36,30.55)
IO44_RX: length 23.4
  Top Layer w0.254: v1(12.71,24.94) 12.71,32.91 U7.36 ; R22.2 20.33,13.51 v1(19.82,14.02)
  Bottom Layer w0.254: v1(19.82,14.02) 17.28,16.56 17.28,20.37 v1(12.71,24.94)
IO45_EXD: length 18
  Top Layer w0.254: v1(23.78,40.54) 20.48,40.54 18.19,42.83 18.19,43.59 HDR2.10 ; v1(26.07,35.71) 26.07,31.99 U7.26
  Bottom Layer w0.254: v1(26.07,35.71) 26.07,38.25 v1(23.78,40.54)
IO46_EXD: length 27.7
  Top Layer w0.254: U7.16 25.59,18.53 26.35,19.29 26.35,19.54 v1(26.61,19.8) ; v1(12.49,35.29) 12.49,37.59 HDR2.5
  Bottom Layer w0.254: v1(12.49,35.29) 11.73,34.53 11.73,33.4 25.33,19.8 v1(26.61,19.8)
IO47_EXD: length 17.1
  Top Layer w0.254: v1(20.62,41.27) HDR2.12 ; 25.33,28.69 25.08,28.69 v1(22.54,31.23)
  Bottom Layer w0.254: v1(20.62,41.27) 22.54,39.35 v1(22.54,31.23)
IO48_EXD: length 14.8
  Top Layer w0.254: v1(23.81,31.23) 25.08,29.95 U7.25 ; v1(23.16,41.42) HDR2.14
  Bottom Layer w0.254: v1(23.16,41.42) 23.16,40.26 23.81,39.61 v1(23.81,31.23)
MAX_3V3: length 24.5
  Top Layer w0.25: v1(35.67,32.15) 35.67,32.9 R33.2 ; R30.1 40.66,23.63 40.66,24.9 39.89,25.66 39.64,25.66 38.88,26.42 38.88,28.2 38.72,28.35 U10.7 U10.8 v1(38.21,29.61)
  Top Layer w0.254: C14.1 36.74,21.01 C15.1 37.56,18.79 38.58,18.79 39.09,19.29 39.09,20.56 39.85,21.33 ; R30.1 39.85,22.82 39.85,21.33 ; 39.85,21.33 R32.1
  Bottom Layer w0.25: v1(38.21,29.61) v1(35.67,32.15)
RTS: length 14.6
  Top Layer w0.254: U8.14 27.66,25.16 29.18,26.67 29.18,27.18 28.67,27.69 28.67,32.01 R21.2 26.93,34.77 v1(27.18,35.02) ; v1(27.37,36.73) Q5.2
  Bottom Layer w0.254: v1(27.37,36.73) 27.18,36.54 v1(27.18,35.02)
SD_MODE: length 4.1
  Top Layer w0.25: R29.2 38.39,25.67 U10.4
  Top Layer w0.254: R29.2 R30.2
USB_5V: length 94.4
  Top Layer w0.3: 46.48,20.2 R3.2 46.48,20.89 46.99,21.4 46.99,23.68 46.23,24.44 46.23,25.32 ; 46.48,20.2 R13.1 44.9,18.61 ; 46.48,20.2 46.91,19.77 U2.A9 U2.B4 ; 46.23,25.32 47.42,26.51 U1.A4 U1.B9 ; 46.23,25.32 D1.2 45.39,25.37 44.63,26.13 44.63,29.69 45.13,30.2 45.16,30.2 ; 45.66,16.33 45.66,15.91 R12.1 ; 45.66,16.33 45.7,16.37 45.7,17.6 44.94,18.36 44.94,18.57 44.9,18.61 ; 45.66,16.33 45.92,16.07 46.93,16.07 47.19,15.82 47.19,15.31 47.53,14.97 U2.B9 U2.A4 ; 45.16,30.2 45.67,30.7 46.94,30.7 47.55,31.31 U1.B4 U1.A9 ; 45.16,30.2 44.15,31.21 44.15,35.78 42.62,37.31 v1(41.35,37.31) ; 43.31,18.61 44.9,18.61 ; 43.31,18.61 U4.8 42.59,17.89 42.34,17.89 41.58,17.13 41.58,14.85 41.02,14.3 U4.4 33.55,14.3 C7.2 ; 43.31,18.61 43.31,19.71 R4.2 ; HDR2.1 9.87,40.05 11.33,40.05 12.4,41.12 12.91,41.12 13.41,40.61 18.24,40.61 v1(18.75,40.1)
  Bottom Layer w0.3: v1(18.75,40.1) 18.75,40.36 20.53,42.13 23.57,42.13 25.23,40.48 38.18,40.48 v1(41.35,37.31)
USB_D+: length 27.4
  Top Layer w0.254: 48.73,17.97 48.81,18.04 v1(49.06,18.04) ; 48.73,17.97 U2.B6 ; 48.73,17.97 48.98,17.71 48.98,17.2 48.75,16.97 U2.A6 ; v1(32.13,28.2) 32.63,27.7 U8.5
  Bottom Layer w0.254: v1(32.13,28.2) 34.16,30.23 35.43,30.23 38.73,26.93 41.19,26.93 46.77,21.34 46.77,20.33 v1(49.06,18.04)
USB_D-: length 23.9
  Top Layer w0.245: U2.A7 arc(48.1,17.41) 48.05,17.39 47.7,17.39 arc(47.28,16.97) 47.7,16.54 48.05,16.54 arc(48.1,16.52) U2.B7
  Top Layer w0.254: U8.6 33.65,29.47 v1(35.17,29.47) ; U2.A7 47.44,17.47 v1(47.11,17.79)
  Bottom Layer w0.254: v1(35.17,29.47) 38.22,26.42 41.02,26.42 46.35,21.09 46.35,19.06 47.11,18.3 v1(47.11,17.79)
$1N4709: length 6.1
  Top Layer w0.254: U1.A5 48.84,27.81 50.5,26.15 R1.2
$1N4722: length 6.5
  Top Layer w0.254: R2.1 50.61,34.79 50.61,32 49.42,30.81 U1.B5
$1N5072: length 1.6
  Top Layer w0.254: 43.96,21.58 43.96,21.4 R3.1
$1N5555: length 2.2
  Top Layer w0.254: LED1.2 3.95,9.6 2.45,8.1
$1N6052: length 20.4
  Top Layer w0.254: C5.1 21.73,9.69 C6.1 24.52,10.49 24.74,10.49 ; 24.74,10.49 24.74,10.38 L1.2 ; 24.74,10.49 24.74,11.25 23.68,12.31 R7.1 23.68,13.54 26.51,16.37 26.51,18.66 27.01,19.17 27.78,19.17 C4.2 30.78,20.69 R9.2
$1N6054: length 3.3
  Top Layer w0.254: L1.1 28.74,9.58 U3.3
$1N6055: length 10.1
  Top Layer w0.254: U3.5 27.26,14.97 v1(27.52,14.97) ; v1(29.81,18.53) 29.55,18.78 29.55,19.29 ; R11.2 30.99,19.32 R9.1 30.88,19.29 29.55,19.29 ; 29.55,19.29 C4.1
  Bottom Layer w0.254: v1(29.81,18.53) 29.81,17.26 v1(27.52,14.97)
$1N6057: length 10.3
  Top Layer w0.254: R8.1 27.41,17.99 28.23,17.17 28.23,15.06 U3.4 28.83,14.65 31.02,14.65 ; 31.02,14.65 31.02,13.68 C3.2 ; 31.02,14.65 C2.2 32.11,15.41 F1.1
$1N6058: length 5.2
  Top Layer w0.254: R8.2 27.41,16.23 26.14,14.96 26.14,13.06 U3.1
$1N8206: length 1.8
  Top Layer w0.254: R12.2 46.43,13.51 U5.2
$1N8207: length 1.8
  Top Layer w0.254: LED2.2 46.49,16.99 R13.2
$1N8211: length 2.2
  Top Layer w0.254: U4.2 37.25,16.82 R14.2
$1N11656: length 6.4
  Top Layer w0.254: R6.1 50.39,21.58 50.39,20.05 49.31,18.97 U2.B5
$1N11663: length 8.2
  Top Layer w0.254: R5.2 49.94,11.93 50.71,12.69 50.71,14.14 48.93,15.92 48.17,15.92 U2.A5
$2N631: length 12.9
  Top Layer w0.254: 2.41,10.67 C10.2 C9.2 ; 2.41,10.67 2.41,9.65 2.45,9.6 ; 2.41,10.67 2.66,10.41 4.76,10.41 R18.2 6.28,11.18 v1(8.06,12.96) ; v1(8.32,14.48) 8.32,14.99 U7.2
  Bottom Layer w0.254: v1(8.06,12.96) 8.06,14.23 v1(8.32,14.48)
$2N764: length 10.2
  Top Layer w0.254: U7.14 24.05,15.34 22.23,13.51 21.32,13.51 21.06,13.26 21.06,12.24 20.05,11.23 17.64,11.23 16.88,11.99 R20.1
$2N769: length 15.9
  Top Layer w0.254: R19.1 16.63,10.75 v1(16.88,11) ; v1(19.42,17.78) v1(21.45,17.78) ; v1(23.48,16.51) 22.79,15.81 U7.13
  Bottom Layer w0.254: v1(21.45,17.78) 22.72,16.51 v1(23.48,16.51) ; v1(19.42,17.78) 20.44,16.76 20.44,13.8 17.64,11 v1(16.88,11)
$3N640: length 19.9
  Top Layer w0.254: v1(22.6,13) 22.34,12.75 R22.1 ; v1(33.14,21.77) 32.38,21.77 31.87,22.28 31.87,22.79 32.89,23.81 33.06,23.81 U8.2
  Bottom Layer w0.254: v1(33.14,21.77) 33.01,21.64 33.01,19.61 26.41,13 v1(22.6,13)
$3N641: length 11
  Top Layer w0.254: v1(31.51,21.67) 31.25,21.93 31.25,23.45 32.95,25.16 U8.3 ; v1(30.74,18.37) 30.74,17.86 29.22,16.34 R23.1
  Bottom Layer w0.254: v1(31.51,21.67) 30.74,20.91 v1(30.74,18.37)
$3N2290: length 2
  Top Layer w0.25: R34.1 36.96,31.07 U10.10
$3N2291: length 2.2
  Top Layer w0.25: R35.1 37.46,30.67 U10.9
$3N2292: length 10
  Top Layer w0.245: 36.57,34.97 36.19,34.97 arc(35.3,35.34) C17.2
  Top Layer w0.254: R34.2 36.57,34.97 42.17,34.97 喇叭.2
$3N2293: length 13.4
  Top Layer w0.254: 42.93,35.04 43.36,35.04 喇叭.1 ; 42.93,35.04 42.93,35.55 42.42,36.06 38.43,36.06 38.31,36.18 C16.2 ; 42.93,35.04 42.93,34.28 41.6,32.95 R35.2
$3N9618: length 2.3
  Top Layer w0.254: R26.1 0.84,36.9 U9.4
$3N9620: length 25.3
  Top Layer w0.254: U9.5 0.96,35.13 1.65,35.83 v1(3.54,35.83) 5.57,35.83 R28.1 ; v1(14.56,35.57) R27.1
  Bottom Layer w0.254: v1(14.56,35.57) 10.5,39.64 3.28,39.64 2.27,38.62 2.27,38.37 3.54,37.1 v1(3.54,35.83)
$3N12428: length 5.2
  Top Layer w0.254: R21.1 30.21,35.53 30.21,36.71 Q4.1
$3N12472: length 2
  Top Layer w0.254: R25.1 27.57,36.06 Q5.1
$4N844: length 13.1
  Top Layer w0.254: R40.1 14.4,11 19.23,6.18 v1(20.5,6.18) ; v1(22.23,6.03) 22.8,6.03 23.55,5.28 23.55,4.77 LED灯.3
  Bottom Layer w0.254: v1(20.5,6.18) 22.08,6.18 v1(22.23,6.03)
$4N967: length 39
  Top Layer w0.245: 音量.3 44.08,4.65 arc(44,4.24) 43.77,3.9 arc(43.49,3.71) 43.17,3.65 37.02,3.65 arc(36.05,3.84) 35.22,4.39 v1(34.74,4.88)
  Top Layer w0.254: R38.1 11.12,9.96 14.82,9.96 19.39,5.39 v1(20.01,5.39)
  Bottom Layer w0.254: v1(20.01,5.39) 34.23,5.39 v1(34.74,4.88)
$4N1500: length 3
  Top Layer w0.254: 按钮.3 33.71,5.87 R39.1

## Copper pours and planes (outline as drawn; the poured copper is in the pictures)
GND on Top Layer: -3.82,55.48 56.78,55.48 56.78,-5.9 -3.82,-5.9
GND on Bottom Layer: -1.94,60.9 55.9,60.9 55.9,-9.88 -1.94,-9.88

## Text on the board
Bottom Silkscreen Layer: https://espai.fun | ESP-AI v1.0.2
Top Silkscreen Layer: +
